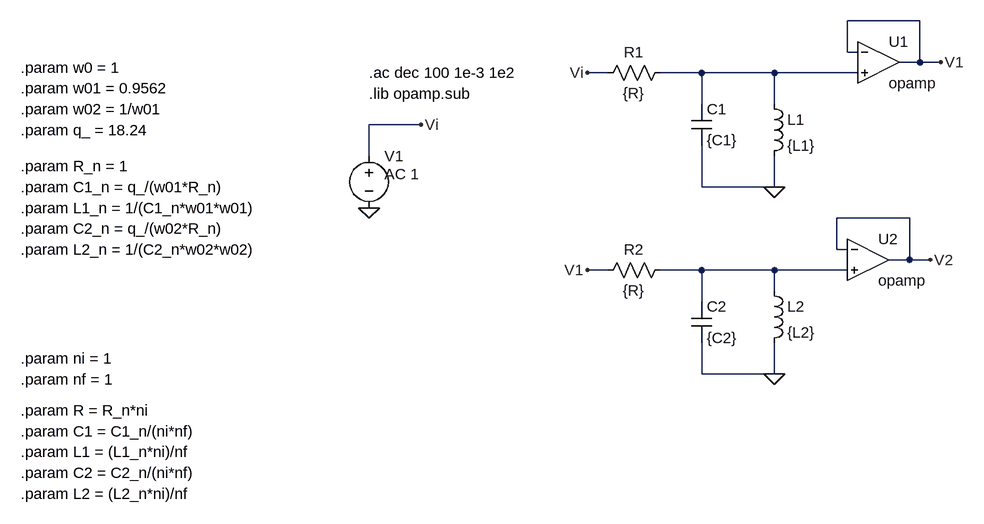
[diagram p0: schematic 1P_pasivo.asc]
1P_pasivo.asc, the LTspice schematic file:
Version 4
SHEET 1 880 680
WIRE -240 -624 -352 -624
WIRE -352 -576 -352 -624
WIRE -336 -576 -352 -576
WIRE -240 -560 -240 -624
WIRE -240 -560 -272 -560
WIRE -208 -560 -240 -560
WIRE -720 -544 -752 -544
WIRE -576 -544 -640 -544
WIRE -464 -544 -576 -544
WIRE -336 -544 -464 -544
WIRE -576 -496 -576 -544
WIRE -464 -496 -464 -544
WIRE -1008 -464 -1088 -464
WIRE -1088 -416 -1088 -464
WIRE -576 -368 -576 -432
WIRE -464 -368 -464 -416
WIRE -464 -368 -576 -368
WIRE -256 -320 -368 -320
WIRE -368 -272 -368 -320
WIRE -352 -272 -368 -272
WIRE -256 -256 -256 -320
WIRE -256 -256 -288 -256
WIRE -224 -256 -256 -256
WIRE -720 -240 -752 -240
WIRE -576 -240 -640 -240
WIRE -464 -240 -576 -240
WIRE -352 -240 -464 -240
WIRE -464 -208 -464 -240
WIRE -576 -192 -576 -240
WIRE -576 -80 -576 -128
WIRE -464 -80 -464 -128
WIRE -464 -80 -576 -80
FLAG -464 -368 0
FLAG -752 -544 Vi
FLAG -208 -560 V1
FLAG -1088 -336 0
FLAG -1008 -464 Vi
FLAG -224 -256 V2
FLAG -464 -80 0
FLAG -752 -240 V1
SYMBOL res -624 -560 R90
WINDOW 0 0 56 VBottom 2
WINDOW 3 32 56 VTop 2
SYMATTR InstName R1
SYMATTR Value {R}
SYMBOL cap -592 -496 R0
SYMATTR InstName C1
SYMATTR Value {C1}
SYMBOL ind -480 -512 R0
SYMATTR InstName L1
SYMATTR Value {L1}
SYMBOL Opamps\\opamp -304 -624 R0
SYMATTR InstName U1
SYMBOL res -624 -256 R90
WINDOW 0 0 56 VBottom 2
WINDOW 3 32 56 VTop 2
SYMATTR InstName R2
SYMATTR Value {R}
SYMBOL cap -592 -192 R0
SYMATTR InstName C2
SYMATTR Value {C2}
SYMBOL ind -480 -224 R0
SYMATTR InstName L2
SYMATTR Value {L2}
SYMBOL voltage -1088 -432 R0
WINDOW 123 24 44 Left 2
WINDOW 39 0 0 Left 2
SYMATTR Value2 AC 1
SYMATTR InstName V1
SYMATTR Value ""
SYMBOL Opamps\\opamp -320 -320 R0
SYMATTR InstName U2
TEXT -1088 -544 Left 2 !.ac dec 100 1e-3 1e2
TEXT -1088 -512 Left 2 !.lib opamp.sub
TEXT -1624 -552 Left 2 !.param w0 = 1
TEXT -1624 -400 Left 2 !.param R_n = 1
TEXT -1624 -368 Left 2 !.param C1_n = q_/(w01*R_n)
TEXT -1624 -520 Left 2 !.param w01 = 0.9562
TEXT -1624 -488 Left 2 !.param w02 = 1/w01
TEXT -1624 -456 Left 2 !.param q_ = 18.24
TEXT -1624 -336 Left 2 !.param L1_n = 1/(C1_n*w01*w01)
TEXT -1624 -304 Left 2 !.param C2_n = q_/(w02*R_n)
TEXT -1624 -272 Left 2 !.param L2_n = 1/(C2_n*w02*w02)
TEXT -1624 -104 Left 2 !.param ni = 1
TEXT -1624 -72 Left 2 !.param nf = 1
TEXT -1624 -24 Left 2 !.param R = R_n*ni
TEXT -1624 8 Left 2 !.param C1 = C1_n/(ni*nf)
TEXT -1624 40 Left 2 !.param L1 = (L1_n*ni)/nf
TEXT -1624 72 Left 2 !.param C2 = C2_n/(ni*nf)
TEXT -1624 104 Left 2 !.param L2 = (L2_n*ni)/nf

The netlist it stands for:
* 1P_pasivo.asc
R1 N001 Vi {R}
C1 N001 0 {C1}
L1 N001 0 {L1}
XU1 V1 N001 V1 opamp Aol=100K GBW=10Meg  ; pins invin noninvin out
R2 N002 V1 {R}
C2 N002 0 {C2}
L2 N002 0 {L2}
V1 Vi 0 AC 1
XU2 V2 N002 V2 opamp Aol=100K GBW=10Meg  ; pins invin noninvin out
.ac dec 100 1e-3 1e2
.lib opamp.sub
.param w0 = 1
.param R_n = 1
.param C1_n = q_/(w01*R_n)
.param w01 = 0.9562
.param w02 = 1/w01
.param q_ = 18.24
.param L1_n = 1/(C1_n*w01*w01)
.param C2_n = q_/(w02*R_n)
.param L2_n = 1/(C2_n*w02*w02)
.param ni = 1
.param nf = 1
.param R = R_n*ni
.param C1 = C1_n/(ni*nf)
.param L1 = (L1_n*ni)/nf
.param C2 = C2_n/(ni*nf)
.param L2 = (L2_n*ni)/nf
.backanno
.end